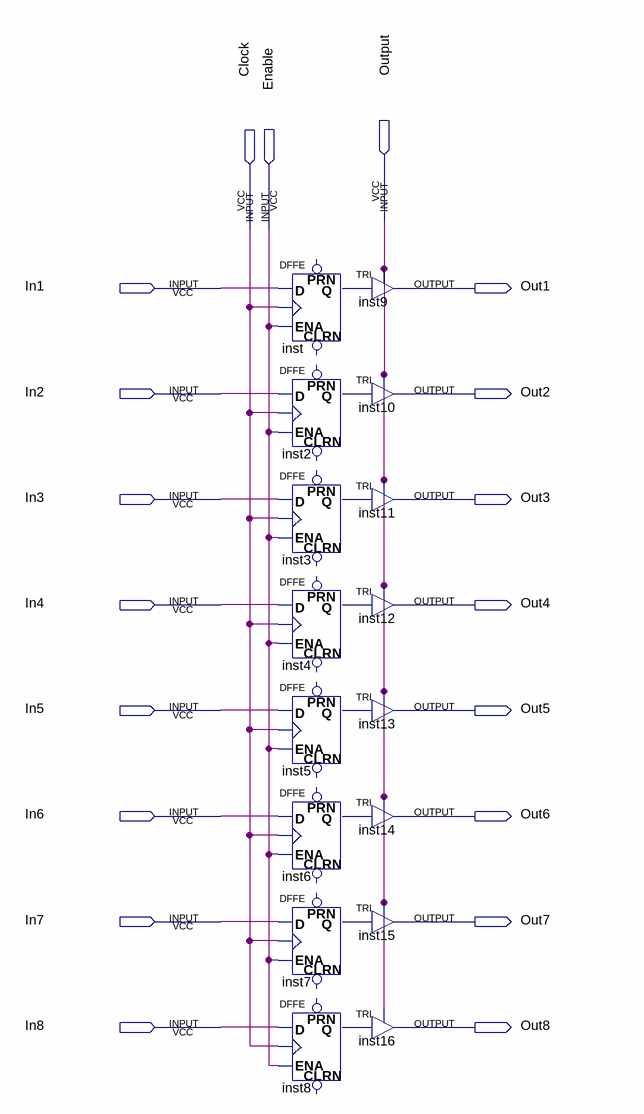
[diagram p0: schematic sheet]
// Quartus schematic 8BitMem.bdf as structural Verilog: 16 symbols, 19 pins
module \8BitMem  (
  input  Output,
  input  Clock,
  input  Enable,
  input  In1,
  input  In2,
  input  In3,
  input  In4,
  input  In5,
  input  In6,
  input  In7,
  input  In8,
  output Out1,
  output Out2,
  output Out3,
  output Out4,
  output Out5,
  output Out6,
  output Out7,
  output Out8
);

  wire inst2_q, inst3_q, inst4_q, inst5_q, inst6_q, inst7_q, inst8_q, inst_q;

  DFFE inst (.D(In1), .CLK(Clock), .ENA(Enable), .Q(inst_q));  // open: PRN, CLRN
  DFFE inst2 (.D(In2), .CLK(Clock), .ENA(Enable), .Q(inst2_q));  // open: PRN, CLRN
  DFFE inst3 (.D(In3), .CLK(Clock), .ENA(Enable), .Q(inst3_q));  // open: PRN, CLRN
  DFFE inst4 (.D(In4), .CLK(Clock), .ENA(Enable), .Q(inst4_q));  // open: PRN, CLRN
  DFFE inst5 (.D(In5), .CLK(Clock), .ENA(Enable), .Q(inst5_q));  // open: PRN, CLRN
  DFFE inst6 (.D(In6), .CLK(Clock), .ENA(Enable), .Q(inst6_q));  // open: PRN, CLRN
  DFFE inst7 (.D(In7), .CLK(Clock), .ENA(Enable), .Q(inst7_q));  // open: PRN, CLRN
  DFFE inst8 (.D(In8), .CLK(Clock), .ENA(Enable), .Q(inst8_q));  // open: PRN, CLRN
  TRI inst9 (.IN(inst_q), .OE(Output), .OUT(Out1));
  TRI inst10 (.IN(inst2_q), .OE(Output), .OUT(Out2));
  TRI inst11 (.IN(inst3_q), .OE(Output), .OUT(Out3));
  TRI inst12 (.IN(inst4_q), .OE(Output), .OUT(Out4));
  TRI inst13 (.IN(inst5_q), .OE(Output), .OUT(Out5));
  TRI inst14 (.IN(inst6_q), .OE(Output), .OUT(Out6));
  TRI inst15 (.IN(inst7_q), .OE(Output), .OUT(Out7));
  TRI inst16 (.IN(inst8_q), .OE(Output), .OUT(Out8));
endmodule
